# Altium project caton-motherboard.PrjPcb (part 2 of 2)

## Sheet caton-ads1299.SchDoc
size A4; SheetNumber: 2; SheetTotal: 2
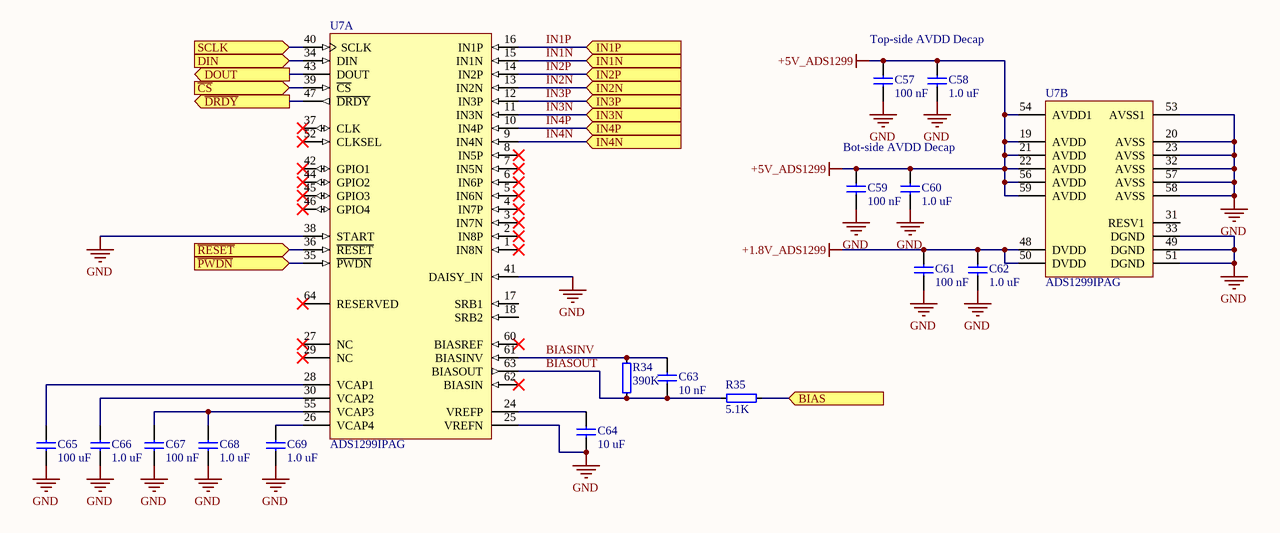
[diagram p2: caton-ads1299.SchDoc]

### Parts
C57  100 nF  [0402]
C58  1.0 uF  [0402]
C59  100 nF  [0402]
C60  1.0 uF  [0402]
C61  100 nF  [0402]
C62  1.0 uF  [0402]
C63  10 nF  [0402]
C64  10 uF  [0402]
C65  100 uF  [0805]
C66  1.0 uF  [0402]
C67  100 nF  [0402]
C68  1.0 uF  [0402]
C69  1.0 uF  [0402]
R34  390K  [0402]
R35  5.1K  [0402]
U7  ADS1299IPAG  [PAG0064A_L]  (parts A,B of 2)

### Ports
BIAS (in), DIN (in), DOUT (out), IN1N (in), IN1P (in), IN2N (in), IN2P (in), IN3N (in), IN3P (in), IN4N (in), IN4P (in), SCLK (in), ~{CS} (in), ~{DRDY} (out), ~{PWDN} (in), ~{RESET} (in)

### Nets
+1.8V_ADS1299: C61.1 C62.1 U7.48(DVDD) U7.50(DVDD)
+5V_ADS1299: C57.1 C58.1 C59.1 C60.1 U7.19(AVDD) U7.21(AVDD) U7.22(AVDD) U7.54(AVDD1) U7.56(AVDD) U7.59(AVDD)
GND: C57.2 C58.2 C59.2 C60.2 C61.2 C62.2 C64.2 C65.2 C66.2 C67.2 C68.2 C69.2 U7.20(AVSS) U7.23(AVSS) U7.25(VREFN) U7.32(AVSS) U7.33(DGND) U7.38(START) U7.41(DAISY_IN) U7.49(DGND) U7.51(DGND) U7.53(AVSS1) U7.57(AVSS) U7.58(AVSS)
BIASINV: C63.1 R34.2 U7.61(BIASINV)
BIASOUT: C63.2 R34.1 R35.2 U7.63(BIASOUT)
IN1N: U7.15(IN1N) ; port IN1N
IN1P: U7.16(IN1P) ; port IN1P
IN2N: U7.13(IN2N) ; port IN2N
IN2P: U7.14(IN2P) ; port IN2P
IN3N: U7.11(IN3N) ; port IN3N
IN3P: U7.12(IN3P) ; port IN3P
IN4N: U7.9(IN4N) ; port IN4N
IN4P: U7.10(IN4P) ; port IN4P
NetC64_1: C64.1 U7.24(VREFP)
NetC65_1: C65.1 U7.28(VCAP1)
NetC66_1: C66.1 U7.30(VCAP2)
NetC67_1: C67.1 C68.1 U7.55(VCAP3)
NetC69_1: C69.1 U7.26(VCAP4)
NetR35_1: R35.1 ; port BIAS
NetU7_34: U7.34(DIN) ; port DIN
NetU7_35: U7.35(~{PWDN}) ; port ~{PWDN}
NetU7_36: U7.36(~{RESET}) ; port ~{RESET}
NetU7_39: U7.39(~{CS}) ; port ~{CS}
NetU7_40: U7.40(SCLK) ; port SCLK
NetU7_43: U7.43(DOUT) ; port DOUT
NetU7_47: U7.47(~{DRDY}) ; port ~{DRDY}

Not connected (* = marked no-connect by the designer): U7 1(IN8N)* 2(IN8P)* 3(IN7N)* 4(IN7P)* 5(IN6N)* 6(IN6P)* 7(IN5N)* 8(IN5P)* 17(SRB1) 18(SRB2) 27(NC)* 29(NC)* 31(RESV1) 37(CLK)* 42(GPIO1)* 44(GPIO2)* 45(GPIO3)* 46(GPIO4)* 52(CLKSEL)* 60(BIASREF)* 62(BIASIN)* 64(RESERVED)*

### Notes on the sheet
- Top-side AVDD Decap
- Bot-side AVDD Decap

### Library data of the parts
C57-C64 C66-C69 = C0402: Capacitor, 0402, X5R, ±20%; Part Number: C0402-4µ7; Manufacturer: N.A.; Part number IPS: 00000001251, 00000007165; Note: 10V; Artikkelnr Noca: 20039482; Pad Count: 2; Manufacturer Part Number: N.A.; LatestRevisionDate: 2017-11-09; Published: 2009-05-08; Footprint Doc: 0402; ComponentLink1Description: Datasheet; ComponentLink1URL: N.A.; ComponentLink2Description: Supplier link; ComponentLink2URL: N.A.; HelpURL: N.A.; Supplier 1: Digi-Key; Supplier Part Number 1: 490-13252-1-ND; Supplier 2: N.A.; Supplier Part Number 2: N.A.; PartId: 100200193; Component Class: Capacitors; Author: rsk; Part number Norautron: N.A.
  C57 C59 C61 C67: Value: 100 nF
  C58 C60 C62 C66 C68 C69: Value: 1.0 uF
  C63: Value: 10 nF
  C64: Value: 10 uF
C65 = C0805: Capacitor, 0805; Part Number: C0603-4µ7; Manufacturer: N.A.; Part number IPS: 00000007783; Note: 6.3V; Artikkelnr Noca: 20069060; Pad Count: 2; Manufacturer Part Number: N.A.; LatestRevisionDate: 2009-11-23; Published: 2009-05-08; Value: 100 uF; Footprint Doc: 0603; ComponentLink1Description: Datasheet; ComponentLink1URL: N.A.; ComponentLink2Description: Supplier link; ComponentLink2URL: N.A.; HelpURL: N.A.; Supplier 1: N.A.; Supplier Part Number 1: N.A.; Supplier 2: N.A.; Supplier Part Number 2: N.A.; PartId: 100200274; Component Class: Capacitors; Author: rsk; Part number Norautron: N.A.
R34 R35 = R0402: Resistor, 0402, ±1%, 0.05W; Part Number: R0201-10k; Manufacturer: N.A.; Part number IPS: 00000001255; Note: Chip Res 1%; Pad Count: 2; Manufacturer Part Number: N.A.; LatestRevisionDate: 2014-11-13; Published: 2014-11-13; Artikkelnr Noca: N.A.; Footprint Doc: 0201; ComponentLink1Description: Datasheet; ComponentLink1URL: N.A.; ComponentLink2Description: Supplier link; ComponentLink2URL: N.A.; HelpURL: N.A.; Supplier 1: N.A.; Supplier Part Number 1: N.A.; Supplier 2: N.A.; Supplier Part Number 2: N.A.; PartId: 100100065; Component Class: Resistors; Author: rsk; Part number Norautron: N.A.
  R34: Value: 390K
  R35: Value: 5.1K
U7 = CMP-0841-00002-2: Low-Noise, 8-Channel, 24-Bit Analog Front-End for Biopotential Measurement, 16 KSPS, -40 to 85 degC, 64-Pin PQFP (PAG-64), RoHS, Tube; Manufacturer: Texas Instruments; Architecture: Delta-Sigma; Reference Mode: Int, Ext; # Input Channels: 8; Resolution (Bits): 24; Sample Rate (max) (KSPS): 16; Interface: Serial SPI; Packing: PAG0064A; PackageVersion: 4040282/C; PackageReference: PAG-64; ComponentLink3Description: Package Specification; DatasheetVersion: SBAS499A; ComponentLink1Description: Manufacturer URL; ComponentLink2Description: Datasheet; PackageDescription: 64-Pin Plastic Quad Flatpack, Body 10 x 10 mm, Pitch 0.5 mm; RoHS: TRUE; Operating Temperature Range (C): -40 to 85; ComponentLink3URL: http://www.ti.com/lit/ml/mtqf006a/mtqf006a.pdf; ComponentLink1URL: http://www.ti.com/; ComponentLink2URL: http://www.ti.com/lit/ds/symlink/ads1299.pdf; PartNumber: ADS1299IPAG; Mounting Technology: Surface Mount

## Sheet caton-scum3c.SchDoc
size A; SheetNumber: 1; SheetTotal: 1
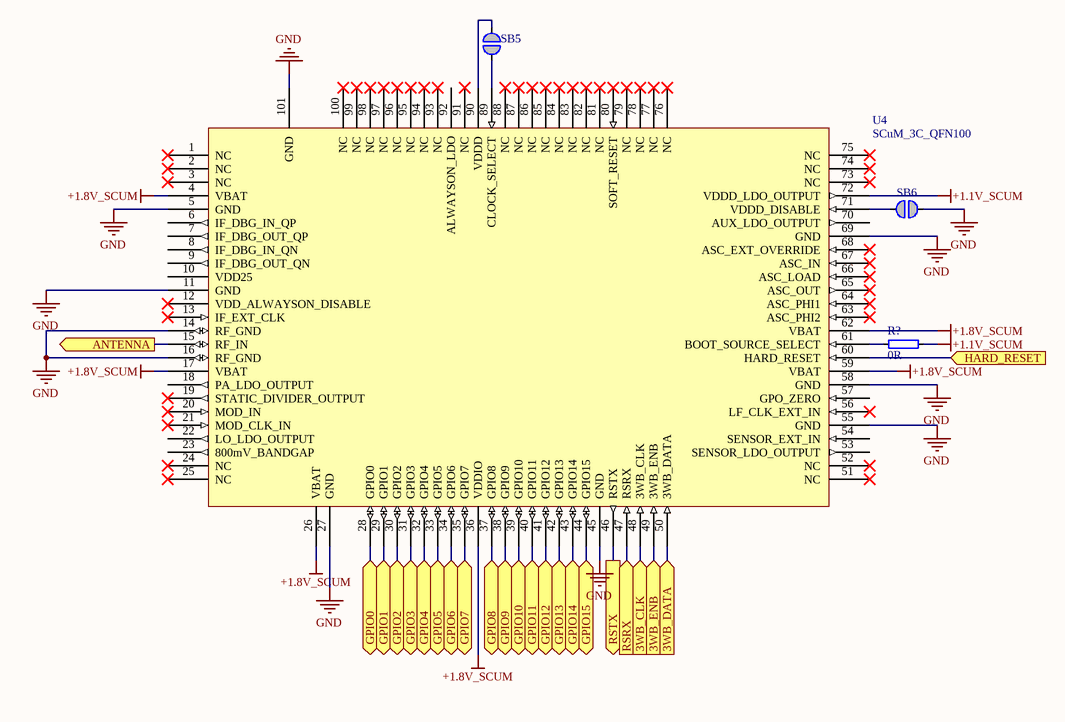
[diagram p3: caton-scum3c.SchDoc]

### Parts
(Parts that share a designator on the sheet are numbered #1, #2 ... from top to bottom, then left to right.)
R?  0R  [RESC0603X03L_C]
SB5  Solderbridge  [Solderbridge]  (value not drawn)  (no BOM)
SB6  Solderbridge  [Solderbridge]  (value not drawn)  (no BOM)
U4#2  SCuM_3C_QFN100  [QFN40P1200X1200X150_HS-101N]

### Ports
3WB_CLK (in), 3WB_DATA (in), 3WB_ENB (in), ANTENNA (out), GPIO0 (bidir), GPIO1 (bidir), GPIO2 (bidir), GPIO3 (bidir), GPIO4 (bidir), GPIO5 (bidir), GPIO6 (bidir), GPIO7 (bidir), GPIO8 (bidir), GPIO9 (bidir), GPIO10 (bidir), GPIO11 (bidir), GPIO12 (bidir), GPIO13 (bidir), GPIO14 (bidir), GPIO15 (bidir), HARD_RESET (in), RSRX (in), RSTX (out)

### Nets
+1.1V_SCUM: R?.2 U4#2.72(VDDD_LDO_OUTPUT)
+1.8V_SCUM: U4#2.4(VBAT) U4#2.17(VBAT) U4#2.26(VBAT) U4#2.36(VDDIO) U4#2.59(VBAT) U4#2.62(VBAT)
GND: SB6.2 U4#2.5(GND) U4#2.11(GND) U4#2.14(RF_GND) U4#2.16(RF_GND) U4#2.27(GND) U4#2.45(GND) U4#2.55(GND) U4#2.58(GND) U4#2.69(GND) U4#2.101(GND)
NetR?_1: R?.1 U4#2.61(BOOT_SOURCE_SELECT)
NetSB5_1: SB5.1 U4#2.90(VDDD)
NetSB5_2: SB5.2 U4#2.89(CLOCK_SELECT)
NetSB6_1: SB6.1 U4#2.71(VDDD_DISABLE)
NetU4#2_15: U4#2.15(RF_IN) ; port ANTENNA
NetU4#2_28: U4#2.28(GPIO0) ; port GPIO0
NetU4#2_29: U4#2.29(GPIO1) ; port GPIO1
NetU4#2_30: U4#2.30(GPIO2) ; port GPIO2
NetU4#2_31: U4#2.31(GPIO3) ; port GPIO3
NetU4#2_32: U4#2.32(GPIO4) ; port GPIO4
NetU4#2_33: U4#2.33(GPIO5) ; port GPIO5
NetU4#2_34: U4#2.34(GPIO6) ; port GPIO6
NetU4#2_35: U4#2.35(GPIO7) ; port GPIO7
NetU4#2_37: U4#2.37(GPIO8) ; port GPIO8
NetU4#2_38: U4#2.38(GPIO9) ; port GPIO9
NetU4#2_39: U4#2.39(GPIO10) ; port GPIO10
NetU4#2_40: U4#2.40(GPIO11) ; port GPIO11
NetU4#2_41: U4#2.41(GPIO12) ; port GPIO12
NetU4#2_42: U4#2.42(GPIO13) ; port GPIO13
NetU4#2_43: U4#2.43(GPIO14) ; port GPIO14
NetU4#2_44: U4#2.44(GPIO15) ; port GPIO15
NetU4#2_46: U4#2.46(RSTX) ; port RSTX
NetU4#2_47: U4#2.47(RSRX) ; port RSRX
NetU4#2_48: U4#2.48(3WB_CLK) ; port 3WB_CLK
NetU4#2_49: U4#2.49(3WB_ENB) ; port 3WB_ENB
NetU4#2_50: U4#2.50(3WB_DATA) ; port 3WB_DATA
NetU4#2_60: U4#2.60(HARD_RESET) ; port HARD_RESET

Not connected (* = marked no-connect by the designer): U4#2 1(NC)* 2(NC)* 3(NC)* 6(IF_DBG_IN_QP) 7(IF_DBG_OUT_QP) 8(IF_DBG_IN_QN) 9(IF_DBG_OUT_QN) 10(VDD25) 12(VDD_ALWAYSON_DISABLE)* 13(IF_EXT_CLK)* 18(PA_LDO_OUTPUT) 19(STATIC_DIVIDER_OUTPUT)* 20(MOD_IN)* 21(MOD_CLK_IN)* 22(LO_LDO_OUTPUT) 23(800mV_BANDGAP) 24(NC)* 25(NC)* 51(NC)* 52(NC)* 53(SENSOR_LDO_OUTPUT) 54(SENSOR_EXT_IN) 56(LF_CLK_EXT_IN)* 57(GPO_ZERO) 63(ASC_PHI2)* 64(ASC_PHI1)* 65(ASC_OUT)* 66(ASC_LOAD)* 67(ASC_IN)* 68(ASC_EXT_OVERRIDE)* 70(AUX_LDO_OUTPUT) 73(NC)* 74(NC)* 75(NC)* 76(NC)* 77(NC)* 78(NC)* 79(NC)* 80(SOFT_RESET)* 81(NC)* 82(NC)* 83(NC)* 84(NC)* 85(NC)* 86(NC)* 87(NC)* 88(NC)* 91(NC)* 92(ALWAYSON_LDO) 93(NC)* 94(NC)* 95(NC)* 96(NC)* 97(NC)* 98(NC)* 99(NC)* 100(NC)*

### Library data of the parts
R? = R0201-0R: Resistor, ±5%, 0.05W; Manufacturer: N.A.; Part number IPS: 00000003245; Note: Chip Res 5%; Pad Count: 2; Part Number: R0201-0R; Manufacturer Part Number: N.A.; LatestRevisionDate: 2017-11-09; Published: 2014-11-13; Value: 0R; Artikkelnr Noca: N.A.; Footprint Doc: 0201; ComponentLink1Description: Datasheet; ComponentLink1URL: N.A.; ComponentLink2Description: Supplier link; ComponentLink2URL: N.A.; HelpURL: N.A.; Supplier 1: N.A.; Supplier Part Number 1: N.A.; Supplier 2: N.A.; Supplier Part Number 2: N.A.; PartId: 100100001; Component Class: Resistors; Author: rsk; Part number Norautron: N.A.
SB5 SB6 = Solderbridge: Manufacturer: N.A.; Pad Count: 2; Part Number: Solderbridge; Manufacturer Part Number: N.A.; Footprint Doc: Solderbridge; LatestRevisionDate: 2009-12-14; Published: 2009-12-14; Value: Solderbridge; Note: N.A.; Artikkelnr Noca: N.A.; Part number IPS: N.A.; ComponentLink1Description: Datasheet; ComponentLink1URL: N.A.; ComponentLink2Description: Supplier link; ComponentLink2URL: N.A.; HelpURL: N.A.; Supplier 1: N.A.; Supplier Part Number 1: N.A.; Supplier 2: N.A.; Supplier Part Number 2: N.A.; PartId: 100500458; Component Class: Connectors; Author: rsk; Part number Norautron: N.A.

## Nets that join several sheets
+1.1V_SCUM: caton-top (9 pins), caton-scum3c (R?.2 U4#2.72)
+1.8V_ADS1299: caton-top (10 pins), caton-ads1299 (C61.1 C62.1 U7.48 U7.50)
+1.8V_SCUM: caton-top (11 pins), caton-scum3c (6 pins)
+5V_ADS1299: caton-top (14 pins), caton-ads1299 (10 pins)
GND: caton-nrf52840 (47 pins), caton-top (98 pins), caton-ads1299 (24 pins), caton-scum3c (11 pins)